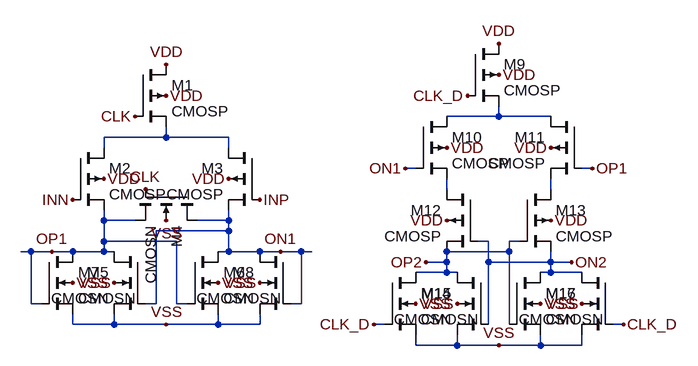
[diagram p0: schematic Latched_Comparator.asc]
Latched_Comparator.asc, the LTspice schematic file:
Version 4
SHEET 1 880 684
WIRE 592 288 592 272
WIRE 592 288 512 288
WIRE 672 288 592 288
WIRE 80 320 80 304
WIRE 80 320 -16 320
WIRE 176 320 80 320
WIRE -16 336 -16 320
WIRE 176 336 176 320
WIRE 464 368 448 368
WIRE 736 368 720 368
WIRE 512 400 512 384
WIRE 672 400 672 384
WIRE -16 448 -16 432
WIRE 32 448 -16 448
WIRE 176 448 176 432
WIRE 176 448 128 448
WIRE 176 464 176 448
WIRE 176 464 64 464
WIRE -16 480 -16 448
WIRE 96 480 -16 480
WIRE 576 480 560 480
WIRE 624 480 608 480
WIRE -128 496 -144 496
WIRE -96 496 -128 496
WIRE -64 496 -96 496
WIRE -16 496 -16 480
WIRE -16 496 -64 496
WIRE 0 496 -16 496
WIRE 176 496 176 464
WIRE 176 496 160 496
WIRE 224 496 176 496
WIRE 256 496 224 496
WIRE 288 496 256 496
WIRE 304 496 288 496
WIRE 608 496 608 480
WIRE 608 496 512 496
WIRE 512 512 512 496
WIRE 512 512 480 512
WIRE 576 512 576 480
WIRE 672 512 672 496
WIRE 672 512 576 512
WIRE 704 512 672 512
WIRE 512 528 512 512
WIRE 512 528 464 528
WIRE 528 528 512 528
WIRE 672 528 672 512
WIRE 672 528 656 528
WIRE 720 528 672 528
WIRE -128 576 -128 496
WIRE -112 576 -128 576
WIRE 64 576 64 464
WIRE 64 576 48 576
WIRE 96 576 96 480
WIRE 112 576 96 576
WIRE 288 576 288 496
WIRE 288 576 272 576
WIRE -64 608 -64 592
WIRE 0 608 0 592
WIRE 0 608 -64 608
WIRE 80 608 0 608
WIRE 160 608 160 592
WIRE 160 608 80 608
WIRE 224 608 224 592
WIRE 224 608 160 608
WIRE 416 608 400 608
WIRE 576 608 576 512
WIRE 608 608 608 496
WIRE 784 608 768 608
WIRE 464 640 464 624
WIRE 528 640 528 624
WIRE 528 640 464 640
WIRE 592 640 528 640
WIRE 656 640 656 624
WIRE 656 640 592 640
WIRE 720 640 720 624
WIRE 720 640 656 640
FLAG -64 544 VSS
FLAG 0 544 VSS
FLAG 160 544 VSS
FLAG 224 544 VSS
FLAG 80 608 VSS
FLAG 80 208 VDD
FLAG 80 256 VDD
FLAG -16 384 VDD
FLAG 176 384 VDD
FLAG 80 448 VSS
FLAG 224 416 INP
FLAG -64 416 INN
FLAG -96 496 OP1
FLAG 256 496 ON1
FLAG 48 400 CLK
FLAG 32 288 CLK
FLAG 592 176 VDD
FLAG 592 224 VDD
FLAG 512 336 VDD
FLAG 672 336 VDD
FLAG 672 448 VDD
FLAG 512 448 VDD
FLAG 464 576 VSS
FLAG 528 576 VSS
FLAG 656 576 VSS
FLAG 720 576 VSS
FLAG 592 640 VSS
FLAG 448 368 ON1
FLAG 736 368 OP1
FLAG 480 512 OP2
FLAG 704 512 ON2
FLAG 784 608 CLK_D
FLAG 400 608 CLK_D
FLAG 544 256 CLK_D
SYMBOL cmosp 32 208 R0
SYMATTR InstName M1
SYMATTR Value2 l=180n w=1u
SYMBOL cmosp -64 336 R0
SYMATTR InstName M2
SYMATTR Value2 l=180n w=2u
SYMBOL cmosp 224 336 M0
SYMATTR InstName M3
SYMATTR Value2 l=180n w=2u
SYMBOL cmosn 128 400 R90
SYMATTR InstName M4
SYMATTR Value2 l=180n w=1u
SYMBOL cmosn 48 496 M0
SYMATTR InstName M5
SYMATTR Value2 l=180n w=0.5u
SYMBOL cmosn 112 496 R0
SYMATTR InstName M6
SYMATTR Value2 l=180n w=0.5u
SYMBOL cmosn -112 496 R0
SYMATTR InstName M7
SYMATTR Value2 l=180n w=0.5u
SYMBOL cmosn 272 496 M0
SYMATTR InstName M8
SYMATTR Value2 l=180n w=0.5u
SYMBOL cmosp 544 176 R0
SYMATTR InstName M9
SYMATTR Value2 l=180n w=8u
SYMBOL cmosp 464 288 R0
SYMATTR InstName M10
SYMATTR Value2 l=180n w=2u
SYMBOL cmosp 720 288 M0
SYMATTR InstName M11
SYMATTR Value2 l=180n w=2u
SYMBOL cmosp 560 400 M0
SYMATTR InstName M12
SYMATTR Value2 l=180n w=6u
SYMBOL cmosp 624 400 R0
SYMATTR InstName M13
SYMATTR Value2 l=180n w=6u
SYMBOL cmosn 416 528 R0
SYMATTR InstName M14
SYMATTR Value2 l=180n w=3u
SYMBOL cmosn 576 528 M0
SYMATTR InstName M15
SYMATTR Value2 l=180n w=3u
SYMBOL cmosn 608 528 R0
SYMATTR InstName M16
SYMATTR Value2 l=180n w=3u
SYMBOL cmosn 768 528 M0
SYMATTR InstName M17
SYMATTR Value2 l=180n w=3u

The netlist it stands for:
* Latched_Comparator.asc
M1 VDD CLK N002 VDD CMOSP l=180n w=1u
M2 N002 INN OP1 VDD CMOSP l=180n w=2u
M3 N002 INP ON1 VDD CMOSP l=180n w=2u
M4 ON1 CLK OP1 VSS CMOSN l=180n w=1u
M5 OP1 ON1 VSS VSS CMOSN l=180n w=0.5u
M6 ON1 OP1 VSS VSS CMOSN l=180n w=0.5u
M7 OP1 OP1 VSS VSS CMOSN l=180n w=0.5u
M8 ON1 ON1 VSS VSS CMOSN l=180n w=0.5u
M9 VDD CLK_D N001 VDD CMOSP l=180n w=8u
M10 N001 ON1 N003 VDD CMOSP l=180n w=2u
M11 N001 OP1 N004 VDD CMOSP l=180n w=2u
M12 N003 ON2 OP2 VDD CMOSP l=180n w=6u
M13 N004 OP2 ON2 VDD CMOSP l=180n w=6u
M14 OP2 CLK_D VSS VSS CMOSN l=180n w=3u
M15 OP2 ON2 VSS VSS CMOSN l=180n w=3u
M16 ON2 OP2 VSS VSS CMOSN l=180n w=3u
M17 ON2 CLK_D VSS VSS CMOSN l=180n w=3u
.model NMOS NMOS
.model PMOS PMOS
.lib standard.mos
.backanno
.end